# EAGLE design pixel (EAGLE 6.4)
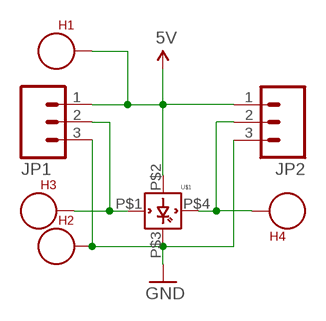
[diagram p0: schematic, sheet 1]

## Parts
H1  SEW_HOLE  [SIMPLE_HOLE]
H2  SEW_HOLE  [SIMPLE_HOLE]
H3  SEW_HOLE  [SIMPLE_HOLE]
H4  SEW_HOLE  [SIMPLE_HOLE]
JP1  M03JST-PTH  [JST-3-PTH]
JP2  M03JST-PTH  [JST-3-PTH]
U$1  NEOPIXEL-PTH-5MM-CLEAR  [LED-5MM-PTH-FUCK-RA]

## Nets
5V: H1.P$1 JP1.1 JP2.1 U$1.P$2(VDD)
GND: H2.P$1 JP1.3 JP2.3 U$1.P$3(GND)
N$1: H3.P$1 JP1.2 U$1.P$1(DIN)
N$2: H4.P$1 JP2.2 U$1.P$4(DOUT)

## Library data of the parts
H1-H4 = LilyPad-Wearables:SEW_HOLE: Simple sew-hole .1" diameter hole with 20mil annular ring
JP1 JP2 = butts:M03: Header 3 Standard 3-pin 0.1" header. Use with straight break away headers (SKU : PRT-00116), right angle break away headers (PRT-00553), swiss pins (PRT-00743), machine pins (PRT-00117), and female headers (PRT-00115). Molex polarized connector foot print use with SKU : PRT-08232 with associated crimp pins and housings.; SKU: PRT-09915
U$1 = butts:NEOPIXEL-PTH-5MM-CLEAR

## Board
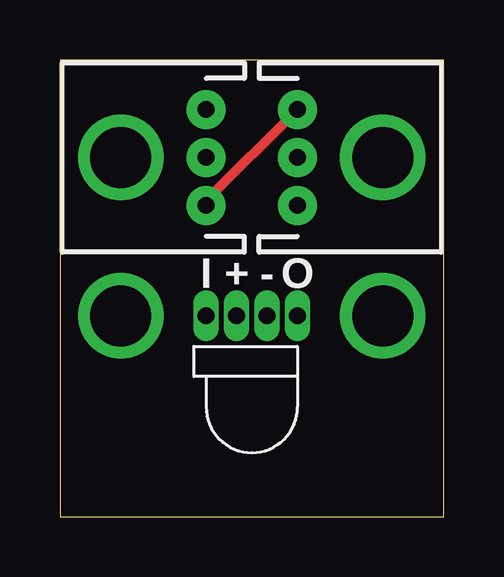
[diagram p1: board, top side]
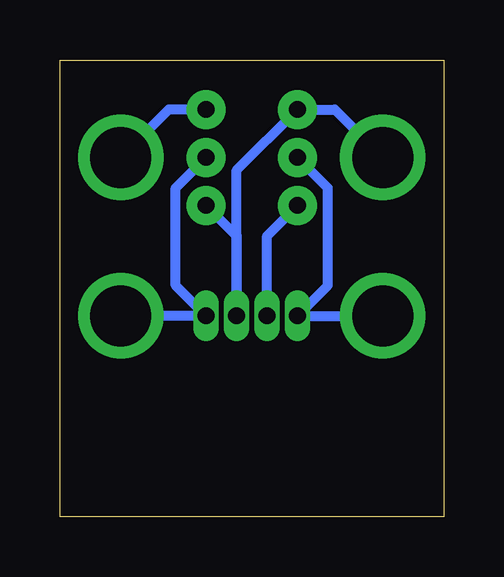
[diagram p2: board, bottom side, seen from below]

Size 16 x 19.05 mm. Coordinates in mm from the lower left corner, seen from the top.
Outline: 0,0 16,0 16,19.05 0,19.05 0,0
Copper layers (1*16): Top 0.0356mm / dielectric 1.5011mm / Bottom 0.0356mm
Design rules "LaenPCBOrder": minimum track width 6mil, minimum drill 13mil, track to track 6mil, track to pad 6mil, pad to pad 6mil, via to via 6mil, smd to smd 6mil, copper to edge 15mil, drill to drill 6mil, minimum pad ring 7mil, minimum via ring 7mil, stop-mask expansion 3mil, vias tented up to drill 0mil, thermal gap 10mil

### Footprints (pad centres in the part's own frame; a part is rotated, then mirrored left to right if it is on the bottom)
SIMPLE_HOLE = drill 2.54 pad 3.048: P$1 0,0
JST-3-PTH = drill 0.7 pad 1.626: 1 -2,0; 2 0,0; 3 2,0
LED-5MM-PTH-FUCK-RA = drill 0.7 pad 0.914 long: P$1 0,0; P$2 1.27,0; P$3 2.54,0; P$4 3.81,0

### Placement (x,y rotation side)
H1  13.46,14.99 0 top
H2  2.54,14.99 0 top
H3  2.54,8.38 0 top
H4  13.46,8.38 0 top
JP1  6.1,14.99 90 top
JP2  9.91,14.99 270 top
U$1  6.1,8.38 0 top

### Tracks (layer width: path | path; a pad name or v marks a point on that pad's centre or on a via)
5V
  Top 0.406: JP2.1 6.1,13.18 JP1.1
  Bottom 0.406: JP2.1 11.46,16.99 H1.P$1 | U$1.P$2 7.37,11.72 JP1.1
GND
  Bottom 0.406: JP2.3 8.64,11.72 U$1.P$3 8.64,14.45 JP1.3 4.54,16.99 H2.P$1
N$1
  Bottom 0.406: H3.P$1 U$1.P$1 4.83,9.65 4.83,13.72 JP1.2
N$2
  Bottom 0.406: H4.P$1 U$1.P$4 11.18,9.65 11.18,13.72 JP2.2